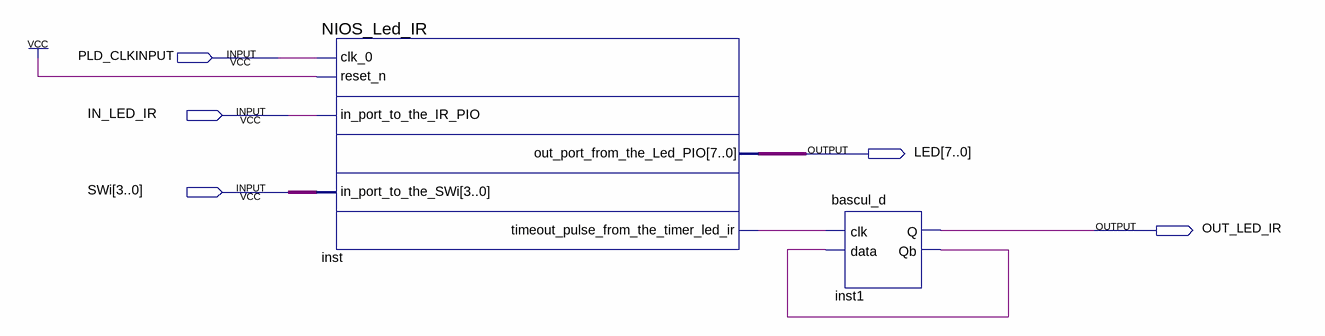
[diagram p0: schematic sheet]
// Quartus schematic Block_Leds_IR.bdf as structural Verilog: 2 symbols, 5 pins
module Block_Leds_IR (
  input  PLD_CLKINPUT,
  input  IN_LED_IR,
  input  [3:0] SWi,
  output [7:0] LED,
  output OUT_LED_IR
);

  wire inst1_qb, inst_timeout_pulse_from_the_timer_led_ir;

  NIOS_Led_IR inst (
    .clk_0(PLD_CLKINPUT), .reset_n(1'b1), .in_port_to_the_IR_PIO(IN_LED_IR), .in_port_to_the_SWi(SWi),
    .out_port_from_the_Led_PIO(LED),
    .timeout_pulse_from_the_timer_led_ir(inst_timeout_pulse_from_the_timer_led_ir));
  bascul_d inst1 (.clk(inst_timeout_pulse_from_the_timer_led_ir), .data(inst1_qb), .Q(OUT_LED_IR), .Qb(inst1_qb));
endmodule
